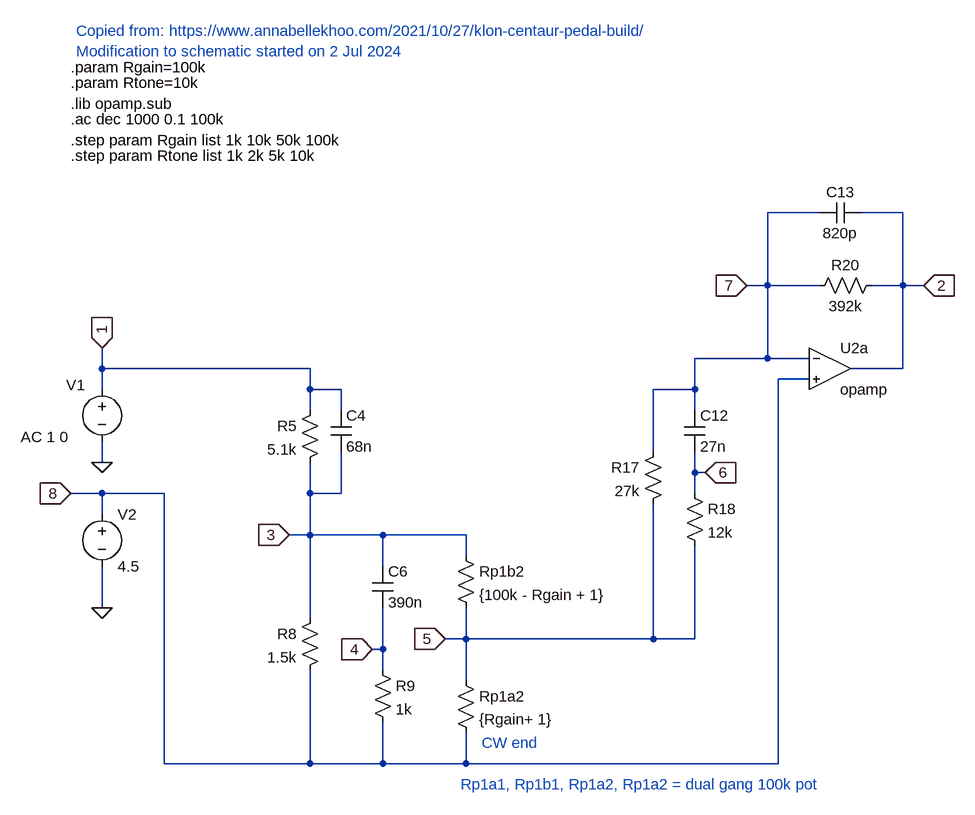
[diagram p0: schematic Klon-Centaur_sum_path_3.asc]
Klon-Centaur_sum_path_3.asc, the LTspice schematic file:
Version 4
SHEET 1 4496 5064
WIRE 576 2320 496 2320
WIRE 704 2320 640 2320
WIRE 496 2432 496 2320
WIRE 496 2432 464 2432
WIRE 576 2432 496 2432
WIRE 704 2432 704 2320
WIRE 704 2432 656 2432
WIRE 736 2432 704 2432
WIRE 496 2544 496 2432
WIRE 496 2544 384 2544
WIRE 560 2544 496 2544
WIRE -528 2560 -528 2528
WIRE -208 2560 -528 2560
WIRE 704 2560 704 2432
WIRE 704 2560 624 2560
WIRE 560 2576 512 2576
WIRE -528 2592 -528 2560
WIRE -208 2592 -208 2560
WIRE -160 2592 -208 2592
WIRE 384 2592 384 2544
WIRE 384 2592 320 2592
WIRE -208 2624 -208 2592
WIRE -160 2624 -160 2592
WIRE 384 2624 384 2592
WIRE 320 2688 320 2592
WIRE -528 2704 -528 2672
WIRE 384 2720 384 2688
WIRE 400 2720 384 2720
WIRE -528 2752 -576 2752
WIRE -432 2752 -528 2752
WIRE -208 2752 -208 2704
WIRE -160 2752 -160 2688
WIRE -160 2752 -208 2752
WIRE 384 2752 384 2720
WIRE -528 2784 -528 2752
WIRE -208 2816 -208 2752
WIRE -208 2816 -240 2816
WIRE -96 2816 -208 2816
WIRE 32 2816 -96 2816
WIRE 32 2848 32 2816
WIRE -96 2864 -96 2816
WIRE -528 2928 -528 2864
WIRE -208 2944 -208 2816
WIRE 32 2976 32 2928
WIRE 32 2976 0 2976
WIRE 320 2976 320 2768
WIRE 320 2976 32 2976
WIRE 384 2976 384 2832
WIRE 384 2976 320 2976
WIRE -96 2992 -96 2928
WIRE -96 2992 -112 2992
WIRE -96 3024 -96 2992
WIRE 32 3040 32 2976
WIRE -432 3168 -432 2752
WIRE -208 3168 -208 3024
WIRE -208 3168 -432 3168
WIRE -96 3168 -96 3104
WIRE -96 3168 -208 3168
WIRE 32 3168 32 3120
WIRE 32 3168 -96 3168
WIRE 512 3168 512 2576
WIRE 512 3168 32 3168
FLAG -528 2528 1
IOPIN -528 2528 In
FLAG -528 2928 0
FLAG -528 2704 0
FLAG 400 2720 6
IOPIN 400 2720 In
FLAG 0 2976 5
IOPIN 0 2976 In
FLAG -112 2992 4
IOPIN -112 2992 In
FLAG -240 2816 3
IOPIN -240 2816 In
FLAG 464 2432 7
IOPIN 464 2432 In
FLAG 736 2432 2
IOPIN 736 2432 In
FLAG -576 2752 8
IOPIN -576 2752 In
SYMBOL voltage -528 2576 R0
WINDOW 0 -55 9 Left 2
WINDOW 123 -125 89 Left 2
WINDOW 39 0 0 Left 0
WINDOW 3 -289 58 Left 2
SYMATTR InstName V1
SYMATTR Value2 AC 1 0
SYMATTR Value ""
SYMBOL res -192 2608 M0
SYMATTR InstName R5
SYMATTR Value 5.1k
SYMBOL res -192 2928 M0
SYMATTR InstName R8
SYMATTR Value 1.5k
SYMBOL cap -176 2624 R0
SYMATTR InstName C4
SYMATTR Value 68n
SYMBOL cap -112 2864 R0
SYMATTR InstName C6
SYMATTR Value 390n
SYMBOL res -112 3008 R0
SYMATTR InstName R9
SYMATTR Value 1k
SYMBOL res 16 2832 R0
SYMATTR InstName Rp1b2
SYMATTR Value {100k - Rgain + 1}
SYMBOL res 16 3024 R0
SYMATTR InstName Rp1a2
SYMATTR Value {Rgain+ 1}
SYMBOL res 336 2672 M0
SYMATTR InstName R17
SYMATTR Value 27k
SYMBOL res 368 2736 R0
SYMATTR InstName R18
SYMATTR Value 12k
SYMBOL cap 368 2624 R0
SYMATTR InstName C12
SYMATTR Value 27n
SYMBOL res 672 2416 R90
WINDOW 0 0 56 VBottom 2
WINDOW 3 32 56 VTop 2
SYMATTR InstName R20
SYMATTR Value 392k
SYMBOL cap 640 2304 R90
WINDOW 0 0 32 VBottom 2
WINDOW 3 32 32 VTop 2
SYMATTR InstName C13
SYMATTR Value 820p
SYMBOL voltage -528 2768 R0
WINDOW 123 0 0 Left 0
WINDOW 39 0 0 Left 0
SYMATTR InstName V2
SYMATTR Value 4.5
SYMBOL OpAmps\\opamp 592 2496 R0
SYMATTR InstName U2a
TEXT -576 2096 Left 2 !.param Rgain=100k
TEXT -576 2120 Left 2 !.param Rtone=10k
TEXT -568 2040 Left 2 ;Copied from: https://www.annabellekhoo.com/2021/10/27/klon-centaur-pedal-build/\nModification to schematic started on 2 Jul 2024
TEXT -576 2152 Left 2 !.lib opamp.sub
TEXT -576 2176 Left 2 !.ac dec 1000 0.1 100k
TEXT 56 3136 Left 2 ;CW end
TEXT -576 2208 Left 2 !.step param Rgain list 1k 10k 50k 100k
TEXT -576 2232 Left 2 !.step param Rtone list 1k 2k 5k 10k
TEXT 24 3200 Left 2 ;Rp1a1, Rp1b1, Rp1a2, Rp1a2 = dual gang 100k pot

The netlist it stands for:
* Klon-Centaur_sum_path_3.asc
V1 1 0 AC 1 0
R5 1 3 5.1k
R8 3 8 1.5k
C4 1 3 68n
C6 3 4 390n
R9 4 8 1k
Rp1b2 3 5 {100k - Rgain + 1}
Rp1a2 5 8 {Rgain+ 1}
R17 7 5 27k
R18 6 5 12k
C12 7 6 27n
R20 2 7 392k
C13 2 7 820p
V2 8 0 4.5
XU2a 7 8 2 opamp Aol=100K GBW=10Meg  ; pins invin noninvin out
.param Rgain=100k
.param Rtone=10k
* Copied from: https://www.annabellekhoo.com/2021/10/27/klon-centaur-pedal-build/
* Modification to schematic started on 2 Jul 2024
.lib opamp.sub
.ac dec 1000 0.1 100k
* CW end
.step param Rgain list 1k 10k 50k 100k
.step param Rtone list 1k 2k 5k 10k
* Rp1a1, Rp1b1, Rp1a2, Rp1a2 = dual gang 100k pot
.backanno
.end